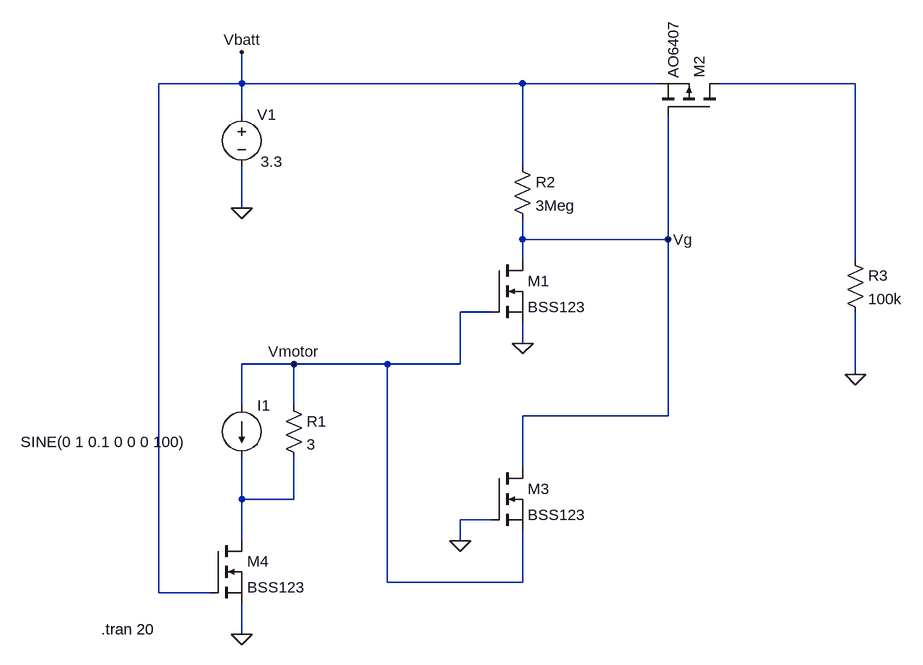
[diagram p0: schematic MovementDet-FET.asc]
MovementDet-FET.asc, the LTspice schematic file:
Version 4
SHEET 1 2120 1076
WIRE -64 -64 -64 -112
WIRE -64 -64 -192 -64
WIRE 368 -64 -64 -64
WIRE 576 -64 368 -64
WIRE 880 -64 672 -64
WIRE -64 -16 -64 -64
WIRE 368 64 368 -64
WIRE -64 128 -64 64
WIRE 368 176 368 144
WIRE 592 176 592 -16
WIRE 592 176 368 176
WIRE 368 208 368 176
WIRE 880 208 880 -64
WIRE 320 288 272 288
WIRE 368 336 368 304
WIRE 16 368 -64 368
WIRE 160 368 16 368
WIRE 272 368 272 288
WIRE 272 368 160 368
WIRE 880 384 880 288
WIRE -64 432 -64 368
WIRE 16 432 16 368
WIRE 592 448 592 176
WIRE 592 448 368 448
WIRE 368 528 368 448
WIRE -64 576 -64 512
WIRE 16 576 16 512
WIRE 16 576 -64 576
WIRE 320 608 272 608
WIRE -64 640 -64 576
WIRE 272 640 272 608
WIRE 160 704 160 368
WIRE 368 704 368 624
WIRE 368 704 160 704
WIRE -192 720 -192 -64
WIRE -112 720 -192 720
WIRE -64 784 -64 736
FLAG -64 128 0
FLAG -64 -112 Vbatt
FLAG 368 336 0
FLAG -64 784 0
FLAG 880 384 0
FLAG 592 176 Vg
FLAG 16 368 Vmotor
FLAG 272 640 0
SYMBOL voltage -64 -32 R0
WINDOW 3 29 88 Left 2
WINDOW 123 0 0 Left 0
WINDOW 39 0 0 Left 0
SYMATTR Value 3.3
SYMATTR InstName V1
SYMBOL nmos 320 208 R0
SYMATTR InstName M1
SYMATTR Value BSS123
SYMBOL current -64 432 R0
WINDOW 3 -340 56 Left 2
WINDOW 123 0 0 Left 0
WINDOW 39 0 0 Left 0
SYMATTR Value SINE(0 1 0.1 0 0 0 100)
SYMATTR InstName I1
SYMBOL res 0 416 R0
SYMATTR InstName R1
SYMATTR Value 3
SYMBOL res 352 48 R0
SYMATTR InstName R2
SYMATTR Value 3Meg
SYMBOL pmos 672 -16 M270
SYMATTR InstName M2
SYMATTR Value AO6407
SYMBOL nmos -112 640 R0
SYMATTR InstName M4
SYMATTR Value BSS123
SYMBOL res 864 192 R0
SYMATTR InstName R3
SYMATTR Value 100k
SYMBOL nmos 320 528 R0
SYMATTR InstName M3
SYMATTR Value BSS123
TEXT -280 776 Left 2 !.tran 20

The netlist it stands for:
* MovementDet-FET.asc
V1 Vbatt 0 3.3
M1 Vg Vmotor 0 0 BSS123
I1 Vmotor N002 SINE(0 1 0.1 0 0 0 100)
R1 Vmotor N002 3
R2 Vbatt Vg 3Meg
M2 N001 Vg Vbatt Vbatt AO6407
M4 N002 Vbatt 0 0 BSS123
R3 N001 0 100k
M3 Vg 0 Vmotor Vmotor BSS123
.model NMOS NMOS
.model PMOS PMOS
.lib standard.mos
.tran 20
.backanno
.end